# Altium schematic sheet Cover.SchDoc
size A3; SheetNumber: 1; SheetTotal: 3
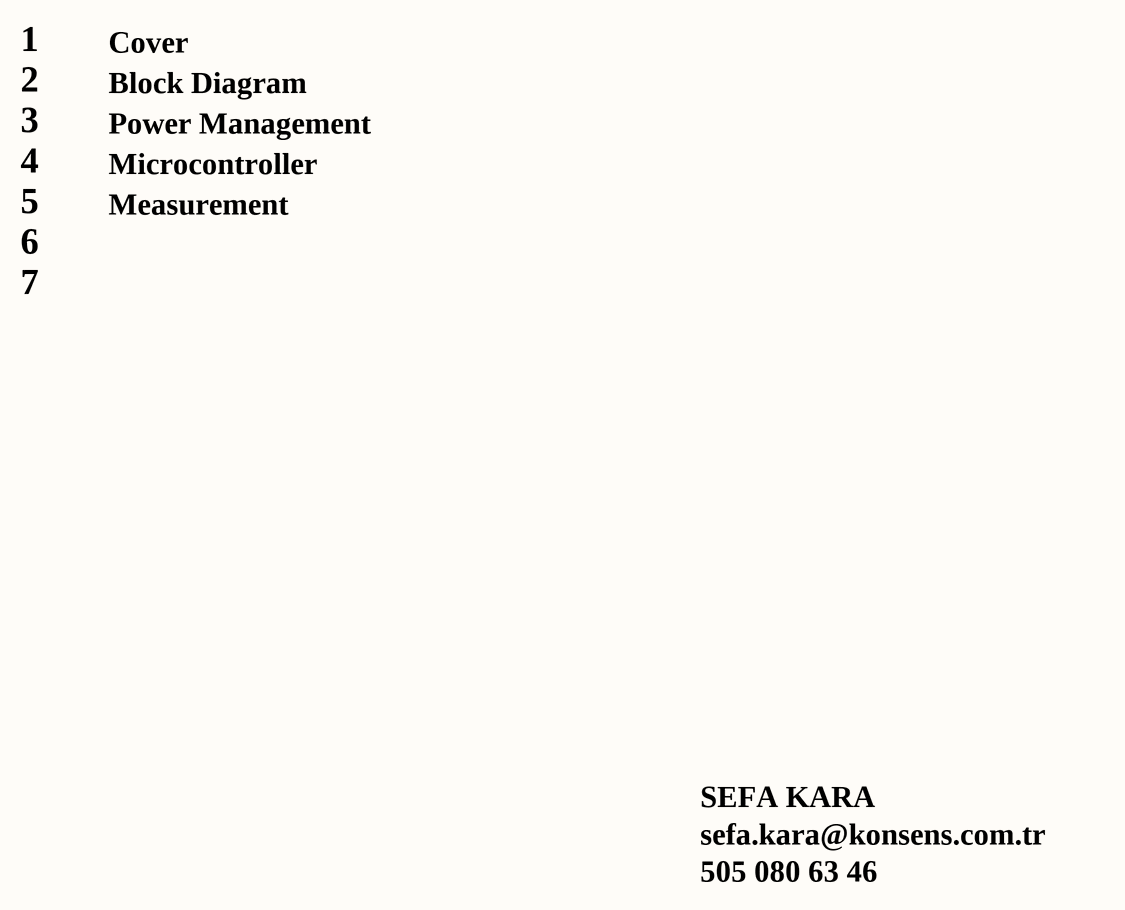
[diagram p0: Cover.SchDoc]

## Notes on the sheet
- 1
- 2
- Cover
- Block Diagram
- 3
- Power Management
- 4
- 5
- Microcontroller
- Measurement
- 6
- 7
- SEFA KARA
- sefa.kara@konsens.com.tr
- 505 080 63 46
- CONTENTS
- REVISION
- PRODUCTION NOTES
- Page No
- Description
- Date
- BOARD
- PROPERTIES
- GERBER
- FILES
- APPENDICES
- CONTACT
- Company Name
- Engineer
- PROJECT
- Rel Date
- FILE NAME
- Checked By
- Approved By
- Rev Date
- Change Date
- Department
- Revision
- Sheet
- of